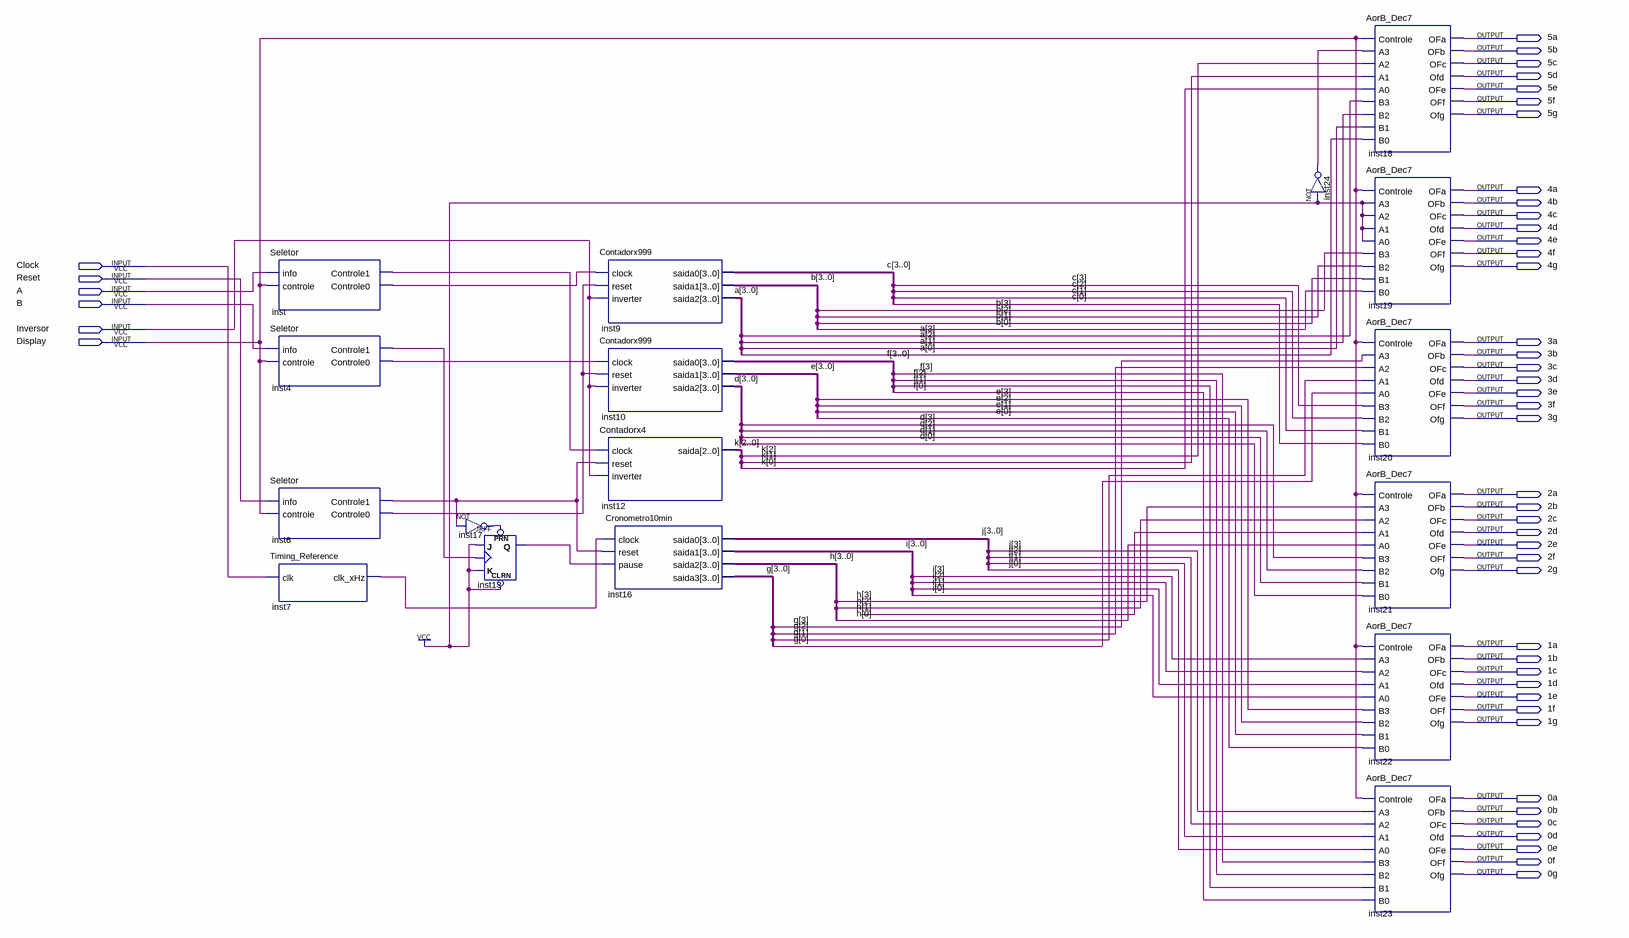
[diagram p0: schematic sheet]
// Quartus schematic Placar_Basquete.bdf as structural Verilog: 17 symbols, 48 pins
module Placar_Basquete (
  input  Clock,
  input  Reset,
  input  A,
  input  B,
  input  Inversor,
  input  Display,
  output \5a ,
  output \5b ,
  output \5c ,
  output \5d ,
  output \5e ,
  output \5f ,
  output \5g ,
  output \4a ,
  output \4b ,
  output \4c ,
  output \4d ,
  output \4e ,
  output \4f ,
  output \4g ,
  output \3a ,
  output \3b ,
  output \3c ,
  output \3d ,
  output \3e ,
  output \3f ,
  output \3g ,
  output \2a ,
  output \2b ,
  output \2c ,
  output \2d ,
  output \2e ,
  output \2f ,
  output \2g ,
  output \1a ,
  output \1b ,
  output \1c ,
  output \1d ,
  output \1e ,
  output \1f ,
  output \1g ,
  output \0a ,
  output \0b ,
  output \0c ,
  output \0d ,
  output \0e ,
  output \0f ,
  output \0g 
);

  wire inst4_controle0, inst4_controle1, inst6_controle0, inst6_controle1, inst7_clk_xhz, inst13_q,
       inst17_out, inst24_out, inst_controle0, inst_controle1;
  wire [2:0] k;
  wire [3:0] A_bus, B_bus, c, d, e, f, g, h, i, j;

  Seletor inst (.info(A), .controle(Display), .Controle1(inst_controle1), .Controle0(inst_controle0));
  Seletor inst4 (.info(B), .controle(Display), .Controle1(inst4_controle1), .Controle0(inst4_controle0));
  Seletor inst6 (.info(Reset), .controle(Display), .Controle1(inst6_controle1), .Controle0(inst6_controle0));
  Timing_Reference inst7 (.clk(Clock), .clk_xHz(inst7_clk_xhz));
  not inst17 (inst17_out, inst6_controle1);
  JKFF inst13 (.PRN(inst17_out), .CLRN(1'b1), .K(1'b1), .J(1'b1), .CLK(inst4_controle1), .Q(inst13_q));
  Contadorx999 inst9 (
    .clock(inst_controle0), .reset(inst6_controle0), .inverter(Inversor), .saida0(c), .saida1(B_bus),
    .saida2(A_bus));
  Contadorx999 inst10 (
    .clock(inst4_controle0), .reset(inst6_controle0), .inverter(Inversor), .saida0(f), .saida1(e), .saida2(d));
  Contadorx4 inst12 (.clock(inst_controle1), .reset(inst6_controle1), .inverter(Inversor), .saida(k));
  Cronometro10min inst16 (
    .clock(inst7_clk_xhz), .reset(inst6_controle1), .pause(inst13_q), .saida0(j), .saida1(i), .saida2(h),
    .saida3(g));
  not inst24 (inst24_out, 1'b1);
  AorB_Dec7 inst18 (
    .Controle(Display), .A3(inst24_out), .A2(k[2]), .A1(k[1]), .A0(k[0]), .B3(A_bus[3]), .B2(A_bus[2]),
    .B1(A_bus[1]), .B0(A_bus[0]), .OFa(\5a ), .OFb(\5b ), .OFc(\5c ), .Ofd(\5d ), .OFe(\5e ), .OFf(\5f ),
    .Ofg(\5g ));
  AorB_Dec7 inst19 (
    .Controle(Display), .A3(1'b1), .A2(1'b1), .A1(1'b1), .A0(1'b1), .B3(B_bus[3]), .B2(B_bus[2]),
    .B1(B_bus[1]), .B0(B_bus[0]), .OFa(\4a ), .OFb(\4b ), .OFc(\4c ), .Ofd(\4d ), .OFe(\4e ), .OFf(\4f ),
    .Ofg(\4g ));
  AorB_Dec7 inst20 (
    .Controle(Display), .A3(g[3]), .A2(g[2]), .A1(g[1]), .A0(g[0]), .B3(c[3]), .B2(c[2]), .B1(c[1]),
    .B0(c[0]), .OFa(\3a ), .OFb(\3b ), .OFc(\3c ), .Ofd(\3d ), .OFe(\3e ), .OFf(\3f ), .Ofg(\3g ));
  AorB_Dec7 inst21 (
    .Controle(Display), .A3(h[3]), .A2(h[2]), .A1(h[1]), .A0(h[0]), .B3(d[3]), .B2(d[2]), .B1(d[1]),
    .B0(d[0]), .OFa(\2a ), .OFb(\2b ), .OFc(\2c ), .Ofd(\2d ), .OFe(\2e ), .OFf(\2f ), .Ofg(\2g ));
  AorB_Dec7 inst22 (
    .Controle(Display), .A3(i[3]), .A2(i[2]), .A1(i[1]), .A0(i[0]), .B3(e[3]), .B2(e[2]), .B1(e[1]),
    .B0(e[0]), .OFa(\1a ), .OFb(\1b ), .OFc(\1c ), .Ofd(\1d ), .OFe(\1e ), .OFf(\1f ), .Ofg(\1g ));
  AorB_Dec7 inst23 (
    .Controle(Display), .A3(j[3]), .A2(j[2]), .A1(j[1]), .A0(j[0]), .B3(f[3]), .B2(f[2]), .B1(f[1]),
    .B0(f[0]), .OFa(\0a ), .OFb(\0b ), .OFc(\0c ), .Ofd(\0d ), .OFe(\0e ), .OFf(\0f ), .Ofg(\0g ));
endmodule
